# EAGLE schematic Adafruit CyberDeck Bonnet (EAGLE 9.6.2)
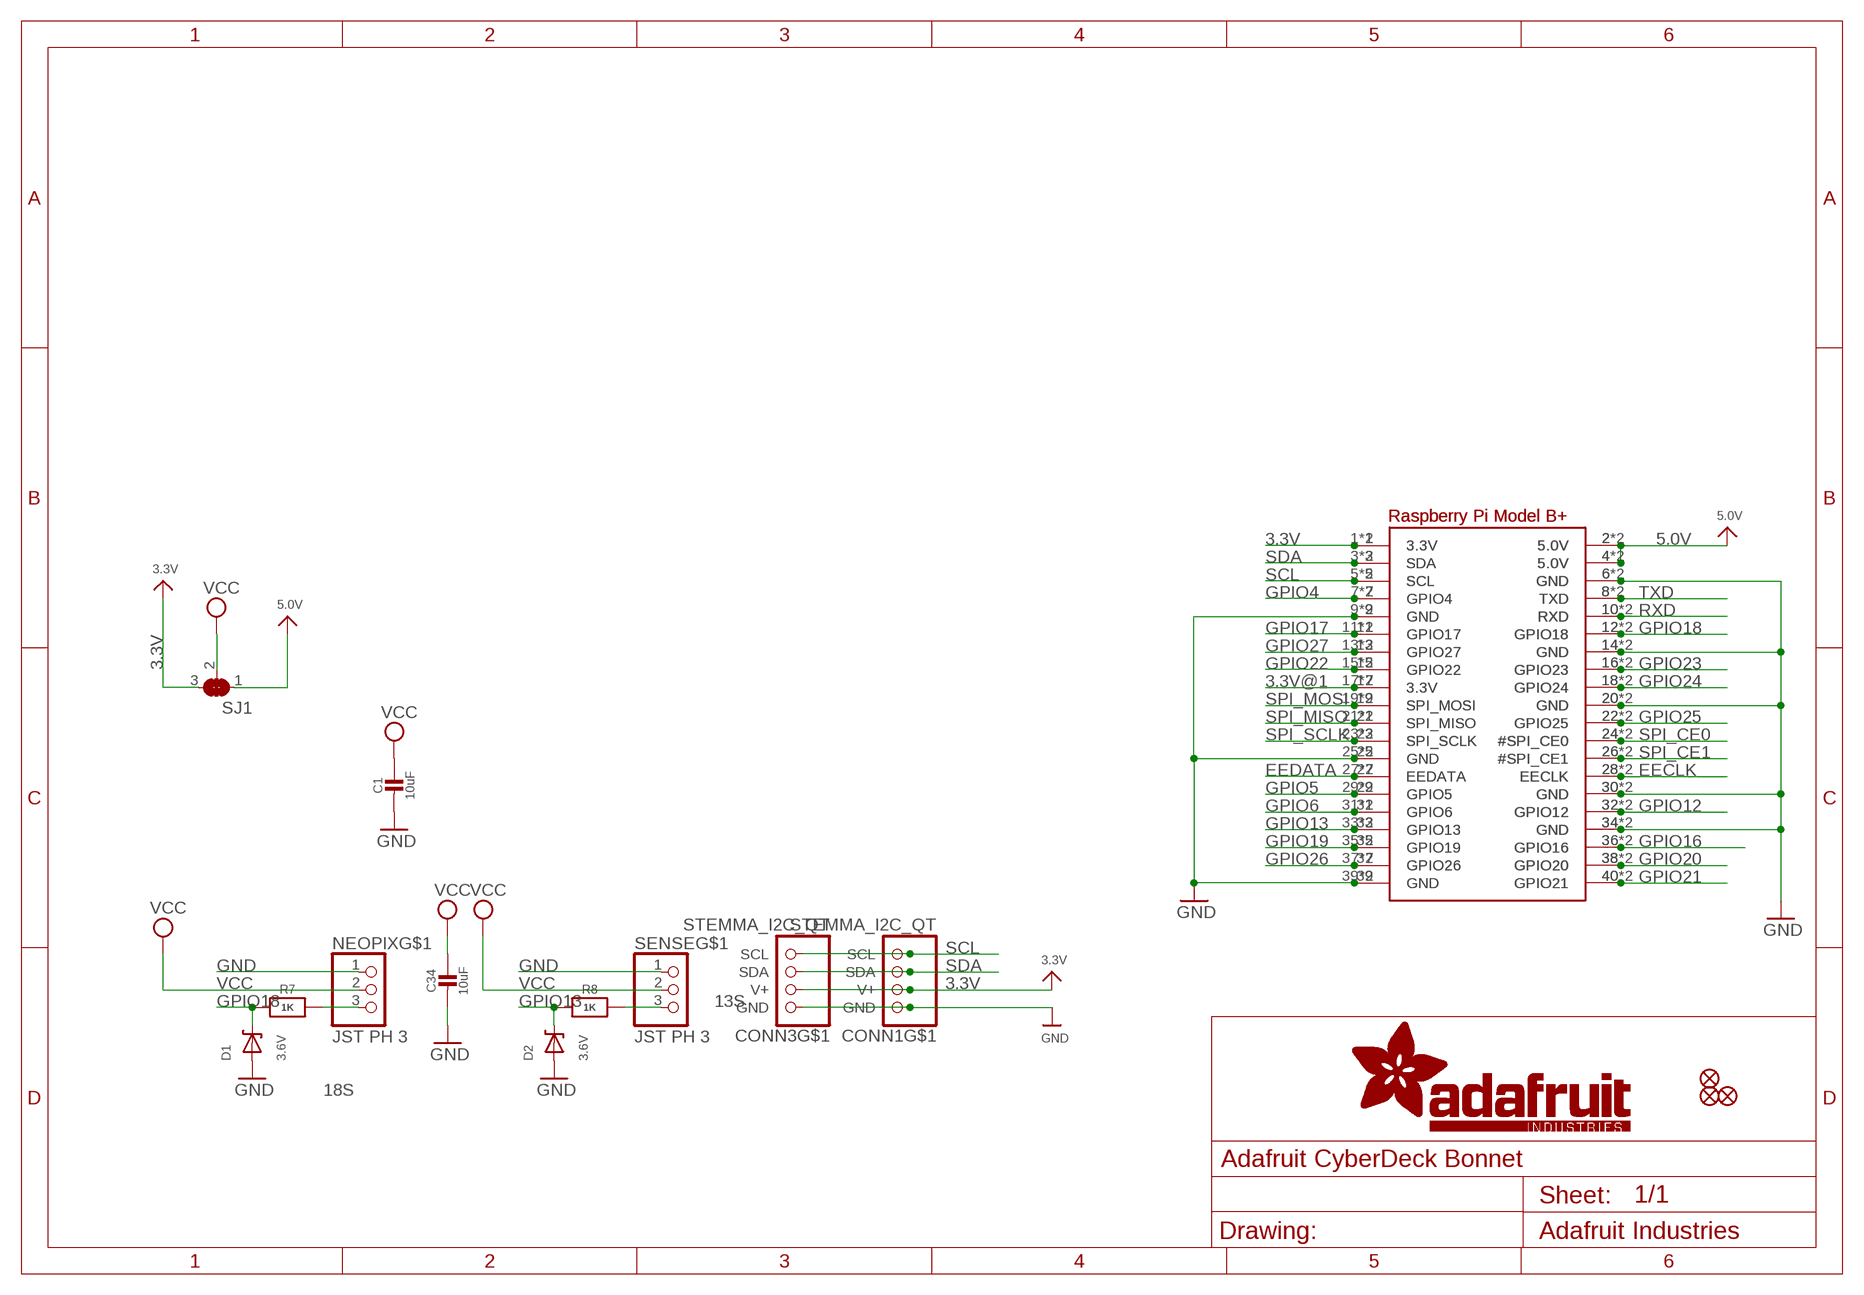
[diagram p0: schematic, sheet 1]

## Parts
C1  10uF  CAP_CERAMIC0805-NOOUTLINE  [0805-NO]
C34  10uF  CAP_CERAMIC0805-NOOUTLINE  [0805-NO]
CONN1  STEMMA_I2C_QT  [JST_SH4]
CONN3  STEMMA_I2C_QT  [JST_SH4]
D1  3.6V  DIODE-ZENERSOD323  [SOD-323]
D2  3.6V  DIODE-ZENERSOD323  [SOD-323]
FID1  FIDUCIAL_1MM  [FIDUCIAL_1MM]
FID2  FIDUCIAL_1MM  [FIDUCIAL_1MM]
FID3  FIDUCIAL_1MM  [FIDUCIAL_1MM]
NEOPIX  JST PH 3  CON_JST_PH_3PIN  [JSTPH3]
R7  1K  RESISTOR_0603_NOOUT  [0603-NO]
R8  1K  RESISTOR_0603_NOOUT  [0603-NO]
RPI1  RASPBERRYPI_BPLUS_IDC  [2X20]
RPI2  RASPBERRYPI_BPLUS_2X20_THMSMT_TOP  [RASPI_2X20_THMSMT_TOP]
SENSE  JST PH 3  CON_JST_PH_3PIN  [JSTPH3]
SJ1  SOLDERJUMPER_2WAY  [SOLDERJUMPER_2WAY_OPEN_NOPASTE]

## Nets
3.3V: CONN1.2(V+) CONN3.2(V+) RPI1.1(3.3V) RPI2.1(3.3V) RPI2.S1(3.3V) SJ1.3
3.3V@1: RPI1.17(3.3V) RPI2.17(3.3V) RPI2.S17(3.3V)
5.0V: RPI1.2(5.0V) RPI1.4(5.0V) RPI2.2(5.0V) RPI2.4(5.0V) RPI2.S2(5.0V) RPI2.S4(5.0V) SJ1.1
13S: R8.1 SENSE.3
18S: NEOPIX.3 R7.1
EECLK: RPI1.28(EECLK) RPI2.28(EECLK) RPI2.S28(EECLK)
EEDATA: RPI1.27(EEDATA) RPI2.27(EEDATA) RPI2.S27(EEDATA)
GND: C1.2 C34.2 CONN1.1(GND) CONN3.1(GND) D1.A D2.A NEOPIX.1 RPI1.6(GND) RPI1.9(GND) RPI1.14(GND) RPI1.20(GND) RPI1.25(GND) RPI1.30(GND) RPI1.34(GND) RPI1.39(GND) RPI2.6(GND) RPI2.9(GND) RPI2.14(GND) RPI2.20(GND) RPI2.25(GND) RPI2.30(GND) RPI2.34(GND) RPI2.39(GND) RPI2.S6(GND) RPI2.S9(GND) RPI2.S14(GND) RPI2.S20(GND) RPI2.S25(GND) RPI2.S30(GND) RPI2.S34(GND) RPI2.S39(GND) SENSE.1
GPIO4: RPI1.7(GPIO4) RPI2.7(GPIO4) RPI2.S7(GPIO4)
GPIO5: RPI1.29(GPIO5) RPI2.29(GPIO5) RPI2.S29(GPIO5)
GPIO6: RPI1.31(GPIO6) RPI2.31(GPIO6) RPI2.S31(GPIO6)
GPIO12: RPI1.32(GPIO12) RPI2.32(GPIO12) RPI2.S32(GPIO12)
GPIO13: D2.C R8.2 RPI1.33(GPIO13) RPI2.33(GPIO13) RPI2.S33(GPIO13)
GPIO16: RPI1.36(GPIO16) RPI2.36(GPIO16) RPI2.S36(GPIO16)
GPIO17: RPI1.11(GPIO17) RPI2.11(GPIO17) RPI2.S11(GPIO17)
GPIO18: D1.C R7.2 RPI1.12(GPIO18) RPI2.12(GPIO18) RPI2.S12(GPIO18)
GPIO19: RPI1.35(GPIO19) RPI2.35(GPIO19) RPI2.S35(GPIO19)
GPIO20: RPI1.38(GPIO20) RPI2.38(GPIO20) RPI2.S38(GPIO20)
GPIO21: RPI1.40(GPIO21) RPI2.40(GPIO21) RPI2.S40(GPIO21)
GPIO22: RPI1.15(GPIO22) RPI2.15(GPIO22) RPI2.S15(GPIO22)
GPIO23: RPI1.16(GPIO23) RPI2.16(GPIO23) RPI2.S16(GPIO23)
GPIO24: RPI1.18(GPIO24) RPI2.18(GPIO24) RPI2.S18(GPIO24)
GPIO25: RPI1.22(GPIO25) RPI2.22(GPIO25) RPI2.S22(GPIO25)
GPIO26: RPI1.37(GPIO26) RPI2.37(GPIO26) RPI2.S37(GPIO26)
GPIO27: RPI1.13(GPIO27) RPI2.13(GPIO27) RPI2.S13(GPIO27)
RXD: RPI1.10(RXD) RPI2.10(RXD) RPI2.S10(RXD)
SCL: CONN1.4(SCL) CONN3.4(SCL) RPI1.5(SCL) RPI2.5(SCL) RPI2.S5(SCL)
SDA: CONN1.3(SDA) CONN3.3(SDA) RPI1.3(SDA) RPI2.3(SDA) RPI2.S3(SDA)
SPI_CE0: RPI1.24(#SPI_CE0) RPI2.24(#SPI_CE0) RPI2.S24(#SPI_CE0)
SPI_CE1: RPI1.26(#SPI_CE1) RPI2.26(#SPI_CE1) RPI2.S26(#SPI_CE1)
SPI_MISO: RPI1.21(SPI_MISO) RPI2.21(SPI_MISO) RPI2.S21(SPI_MISO)
SPI_MOSI: RPI1.19(SPI_MOSI) RPI2.19(SPI_MOSI) RPI2.S19(SPI_MOSI)
SPI_SCLK: RPI1.23(SPI_SCLK) RPI2.23(SPI_SCLK) RPI2.S23(SPI_SCLK)
TXD: RPI1.8(TXD) RPI2.8(TXD) RPI2.S8(TXD)
VCC [power]: C1.1 C34.1 NEOPIX.2 SENSE.2 SJ1.2
Unconnected: CONN1.MT1(MT) CONN1.MT2(MT) CONN3.MT1(MT) CONN3.MT2(MT) NEOPIX.NC1(MT) NEOPIX.NC2(MT) SENSE.NC1(MT) SENSE.NC2(MT)

## Library data of the parts
C1 C34 = microbuilder:CAP_CERAMIC: Ceramic Capacitors For new designs, use the packages preceded by an '_' character since they are more reliable: The following footprints should be used on most boards: _0402 - Standard footprint for regular board layouts _0603 - Standard footprint for regular board layouts _0805 - Standard footprint for regular board layouts _1206 - Standard footprint for regular board layouts For extremely tight-pitch boards where space is at a premium, the following 'micro-pitch' footprints can be used (smaller pads, no silkscreen outline, etc.): _0402MP - Micro-pitch footprint for very dense/compact boards _0603MP - Micro-pitch footprint for very dense/compact boards _0805MP - Micro-pitch footprint for very dense/compact boards _1206MP - Micro-pitch footprint for very dense/compact boards
CONN1 CONN3 = microbuilder:STEMMA_I2C
D1 D2 = microbuilder:DIODE-ZENER: Zener Diode SMA: 30V 1W Zener Diode, 1.2Vf - Digikey: SMAZ30-FDICT-ND
FID1-FID3 = microbuilder:FIDUCIAL: Fiducial Alignment Points Various fiducial points for machine vision alignment.; BOM: EXCLUDE
NEOPIX SENSE = microbuilder:CON_JST_PH_3PIN
R7 R8 = microbuilder:RESISTOR: Resistors For new designs, use the packages preceded by an '_' character since they are more reliable: The following footprints should be used on most boards: _0402 - Standard footprint for regular board layouts _0603 - Standard footprint for regular board layouts _0805 - Standard footprint for regular board layouts _1206 - Standard footprint for regular board layouts For extremely tight-pitch boards where space is at a premium, the following 'micro-pitch' footprints can be used (smaller pads, no silkscreen outline, etc.): _0402MP - Micro-pitch footprint for very dense/compact boards _0603MP - Micro-pitch footprint for very dense/compact boards _0805MP - Micro-pitch footprint for very dense/compact boards _1206MP - Micro-pitch footprint for very dense/compact boards
RPI1 RPI2 = adafruit_sbc:RASPBERRYPI_BPLUS
SJ1 = microbuilder:SOLDERJUMPER_2WAY: 2-Way Solder Jumper

## Net classes
1 power: width 0.305 mm